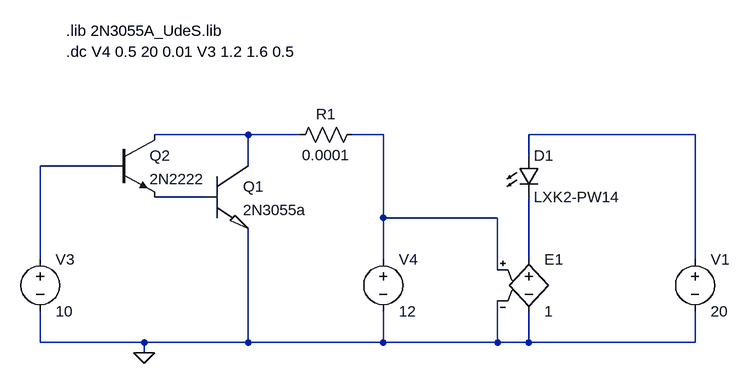
[diagram p0: schematic Draft2.asc]
Draft2.asc, the LTspice schematic file:
Version 4
SHEET 1 1096 680
WIRE 352 288 208 288
WIRE 432 288 352 288
WIRE 560 288 512 288
WIRE 1040 288 784 288
WIRE 784 320 784 288
WIRE 144 336 32 336
WIRE 352 336 352 288
WIRE 288 384 208 384
WIRE 560 416 560 288
WIRE 736 416 560 416
WIRE 32 480 32 336
WIRE 560 480 560 416
WIRE 784 480 784 384
WIRE 1040 480 1040 288
WIRE 736 496 736 416
WIRE 32 608 32 560
WIRE 192 608 32 608
WIRE 352 608 352 432
WIRE 352 608 192 608
WIRE 560 608 560 560
WIRE 560 608 352 608
WIRE 736 608 736 544
WIRE 736 608 560 608
WIRE 784 608 784 560
WIRE 784 608 736 608
WIRE 1040 608 1040 560
WIRE 1040 608 784 608
WIRE 192 624 192 608
FLAG 192 624 0
SYMBOL npn 144 288 R0
SYMATTR InstName Q2
SYMATTR Value 2N2222
SYMBOL res 528 272 R90
WINDOW 0 0 56 VBottom 2
WINDOW 3 32 56 VTop 2
SYMATTR InstName R1
SYMATTR Value 0.0001
SYMBOL 2N3055a 288 336 R0
SYMATTR InstName Q1
SYMBOL voltage 1040 464 R0
SYMATTR InstName V1
SYMATTR Value 20
SYMBOL voltage 32 464 R0
WINDOW 123 0 0 Left 0
WINDOW 39 0 0 Left 0
SYMATTR InstName V3
SYMATTR Value 10
SYMBOL voltage 560 464 R0
WINDOW 123 0 0 Left 0
WINDOW 39 0 0 Left 0
SYMATTR InstName V4
SYMATTR Value 12
SYMBOL e 784 464 R0
SYMATTR InstName E1
SYMATTR Value 1
SYMBOL LED 768 320 R0
SYMATTR InstName D1
SYMATTR Value LXK2-PW14
TEXT 72 128 Left 2 !.lib 2N3055A_UdeS.lib
TEXT 72 160 Left 2 !.dc V4 0.5 20 0.01 V3 1.2 1.6 0.5

The netlist it stands for:
* Draft2.asc
Q2 N001 N004 N005 0 2N2222
R1 N002 N001 0.0001
Q1 N001 N005 0 0 2N3055a
V1 N003 0 20
V3 N004 0 10
V4 N002 0 12
E1 N006 0 N002 0 1
D1 N003 N006 LXK2-PW14
.model D D
.lib standard.dio
.model NPN NPN
.model PNP PNP
.lib standard.bjt
.lib 2N3055A_UdeS.lib
.dc V4 0.5 20 0.01 V3 1.2 1.6 0.5
.lib 2N3055A_UdeS.lib
.backanno
.end